# Altium schematic sheet reefpi_pico_ph.SchDoc: reef-pi isolated pH
size A4; DocumentNumber: 7; SheetNumber: 7; SheetTotal: 8
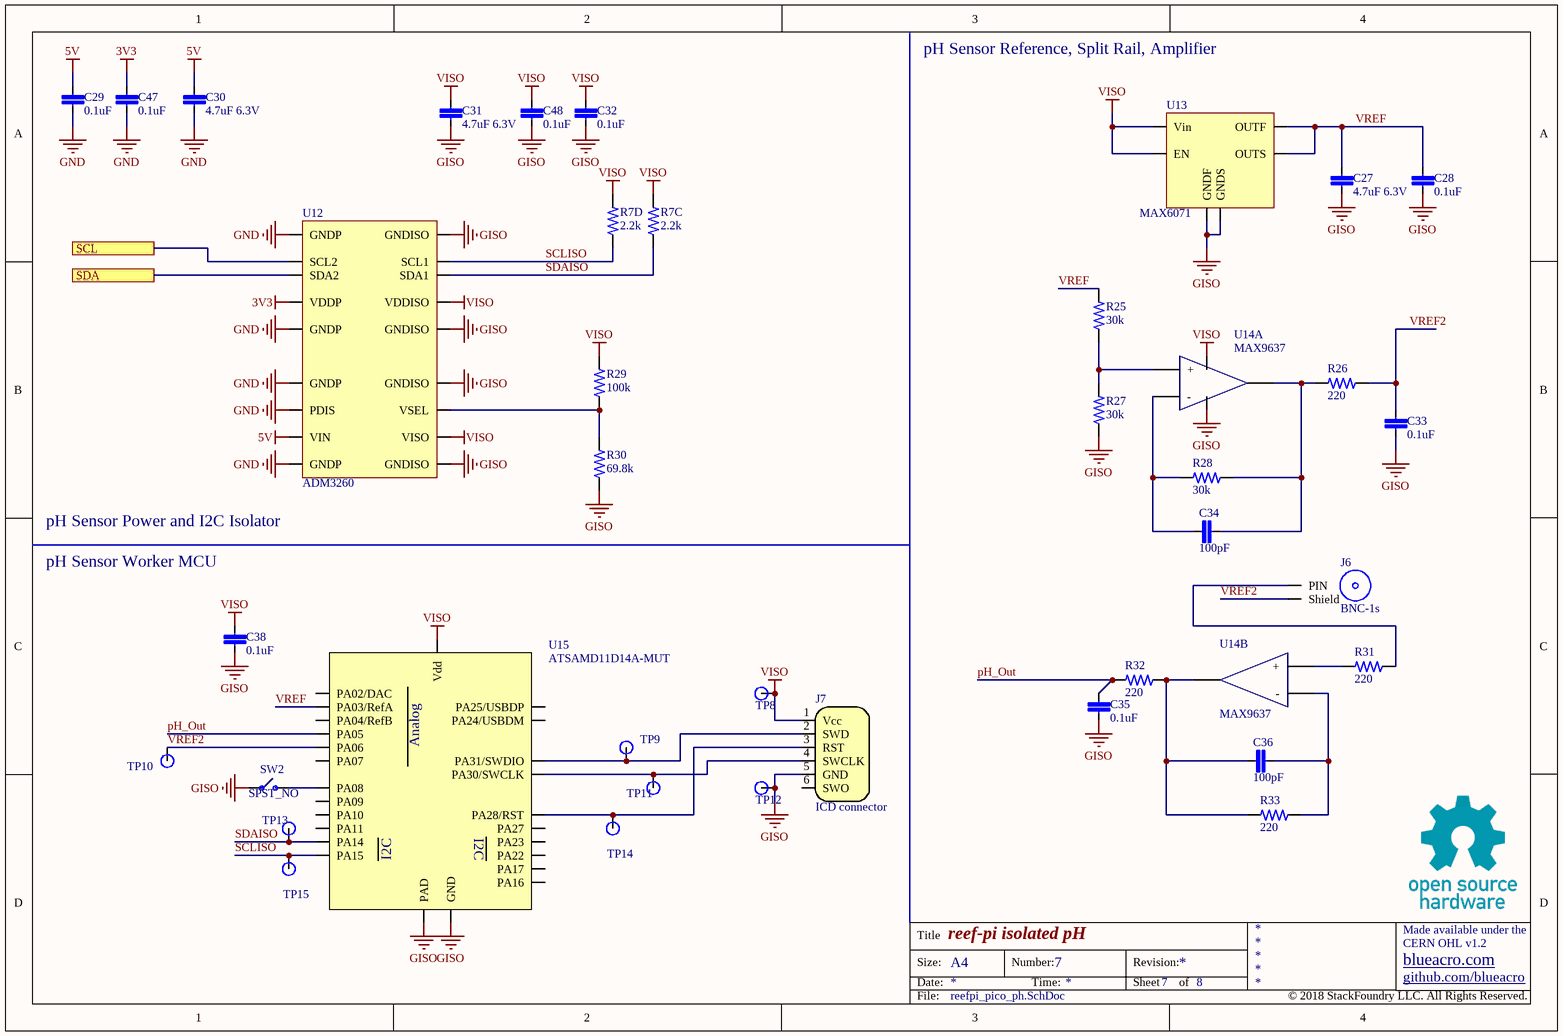
[diagram p0: reefpi_pico_ph.SchDoc]

## Parts
C27  4.7uF 6.3V  [C0603]
C28  0.1uF  [C0603]
C29  0.1uF  [C0603]
C30  4.7uF 6.3V  [C0603]
C31  4.7uF 6.3V  [C0603]
C32  0.1uF  [C0603]
C33  0.1uF  [C0603]
C34  100pF  [C0603]
C35  0.1uF  [C0603]
C36  100pF  [C0603]
C38  0.1uF  [C0603]
C47  0.1uF  [C0603]
C48  0.1uF  [C0603]
J6  BNC-1s  [31-5431-10RFX]
J7  ICD connector  [TC2030-MCP-NL]  (no BOM)
R7  2.2k  [R0603x4]  (parts C,D of 4)
R25  30k  [R0603]
R26  220  [R0603]
R27  30k  [R0603]
R28  30k  [R0603]
R29  100k  [R0603]
R30  69.8k  [R0603]
R31  220  [R0603]
R32  220  [R0603]
R33  220  [R0603]
SW2  SPST_NO  [B3U-1000P]
TP8  TP  [TP_0.89mm]  (value not drawn)
TP9  TP  [TP_0.89mm]  (value not drawn)
TP10  TP  [TP_0.89mm]  (value not drawn)
TP11  TP  [TP_0.89mm]  (value not drawn)
TP12  TP  [TP_0.89mm]  (value not drawn)
TP13  TP  [TP_0.89mm]  (value not drawn)
TP14  TP  [TP_0.89mm]  (value not drawn)
TP15  TP  [TP_0.89mm]  (value not drawn)
U12  ADM3260  [SSOP20]
U13  MAX6071  [SOT23-6L]
U14  MAX9637  [SC70-8]  (parts A,B of 2)
U15  ATSAMD11D14A-MUT  [QFN24-4x4mm-0.5]

## Ports
SCL, SDA

## Nets
3V3: C47.1 U12.4(VDDP)
5V: C29.1 C30.1 U12.9(VIN)
GISO: C27.2 C28.2 C31.2 C32.2 C33.2 C35.2 C38.2 C48.2 J7.5(GND) R27.1 R30.1 SW2.2 TP12.1 U12.11(GNDISO) U12.14(GNDISO) U12.16(GNDISO) U12.20(GNDISO) U13.1(GNDF) U13.2(GNDS) U14.4 U15.23(GND) U15.PAD
GND: C29.2 C30.2 C47.2 U12.1(GNDP) U12.5(GNDP) U12.7(GNDP) U12.8(PDIS) U12.10(GNDP)
VISO: C31.1 C32.1 C38.1 C48.1 J7.1(Vcc) R7.6 R7.8 R29.2 TP8.1 U12.12(VISO) U12.17(VDDISO) U13.3(EN) U13.4(Vin) U14.8 U15.24(Vdd)
pH_Out: C35.1 R32.2 U15.4(PA05)
SCL: U12.2(SCL2) ; port SCL
SCLISO: R7.7 TP15.1 U12.19(SCL1) U15.12(PA15)
SDA: U12.3(SDA2) ; port SDA
SDAISO: R7.5 TP13.1 U12.18(SDA1) U15.11(PA14)
VREF: C27.1 C28.1 R25.2 U13.5(OUTS) U13.6(OUTF) U15.2(PA03/RefA)
VREF2: C33.1 J6.SHIELD(Shield) R26.1 TP10.1 U15.5(PA06)
NetC34_1: C34.1 R28.2 U14.2(-)
NetC34_2: C34.2 R26.2 R28.1 U14.1(OUT)
NetC36_1: C36.1 R32.1 R33.2 U14.7(OUT)
NetC36_2: C36.2 R33.1 U14.6(-)
NetJ6_PIN: J6.PIN R31.1
NetJ7_2: J7.2(SWD) TP9.1 U15.20(PA31/SWDIO)
NetJ7_3: J7.3(RST) TP14.1 U15.18(PA28/RST)
NetJ7_4: J7.4(SWCLK) TP11.1 U15.19(PA30/SWCLK)
NetR25_1: R25.1 R27.2 U14.3(+)
NetR29_1: R29.1 R30.2 U12.13(VSEL)
NetR31_2: R31.2 U14.5(+)
NetSW2_1: SW2.1 U15.7(PA08)

Not connected (* = marked no-connect by the designer): J7 6(SWO); U15 1(PA02/DAC) 3(PA04/RefB) 6(PA07) 8(PA09) 9(PA10) 10(PA11) 13(PA16) 14(PA17) 15(PA22) 16(PA23) 17(PA27) 21(PA24/USBDM) 22(PA25/USBDP)

## Notes on the sheet
- pH Sensor Reference, Split Rail, Amplifier
- pH Sensor Worker MCU
- (near U12) pH Sensor Power and I2C Isolator
- Title
- Size:
- Date:
- A4
- Number:
- Time:
- Revision:
- Sheet
- of
- github.com/blueacro
- blueacro.com
- CERN OHL v1.2
- Made available under the
- File:
- © 2018 StackFoundry LLC. All Rights Reserved.
- (in symbol ATSAMD11D14A-MUT) Analog; I2C

## Library data of the parts
C27-C36 C38 C47 C48 = C-EU
J7 = TC2030-SWD-NL: Conector par ICD
R7 = R-US-4ch
R25-R33 = R-US